# EasyEDA schematic SCH_PCEngineExpansionConnector_2024-10-27.json
TITLE: MegaExpress PC-Engine Expansion Slot Breakout; REV: 1.0; Date: 2024-10-03; Sheet: 1/1; Drawn By: jonn.blanchard; Company: RE:Enthused
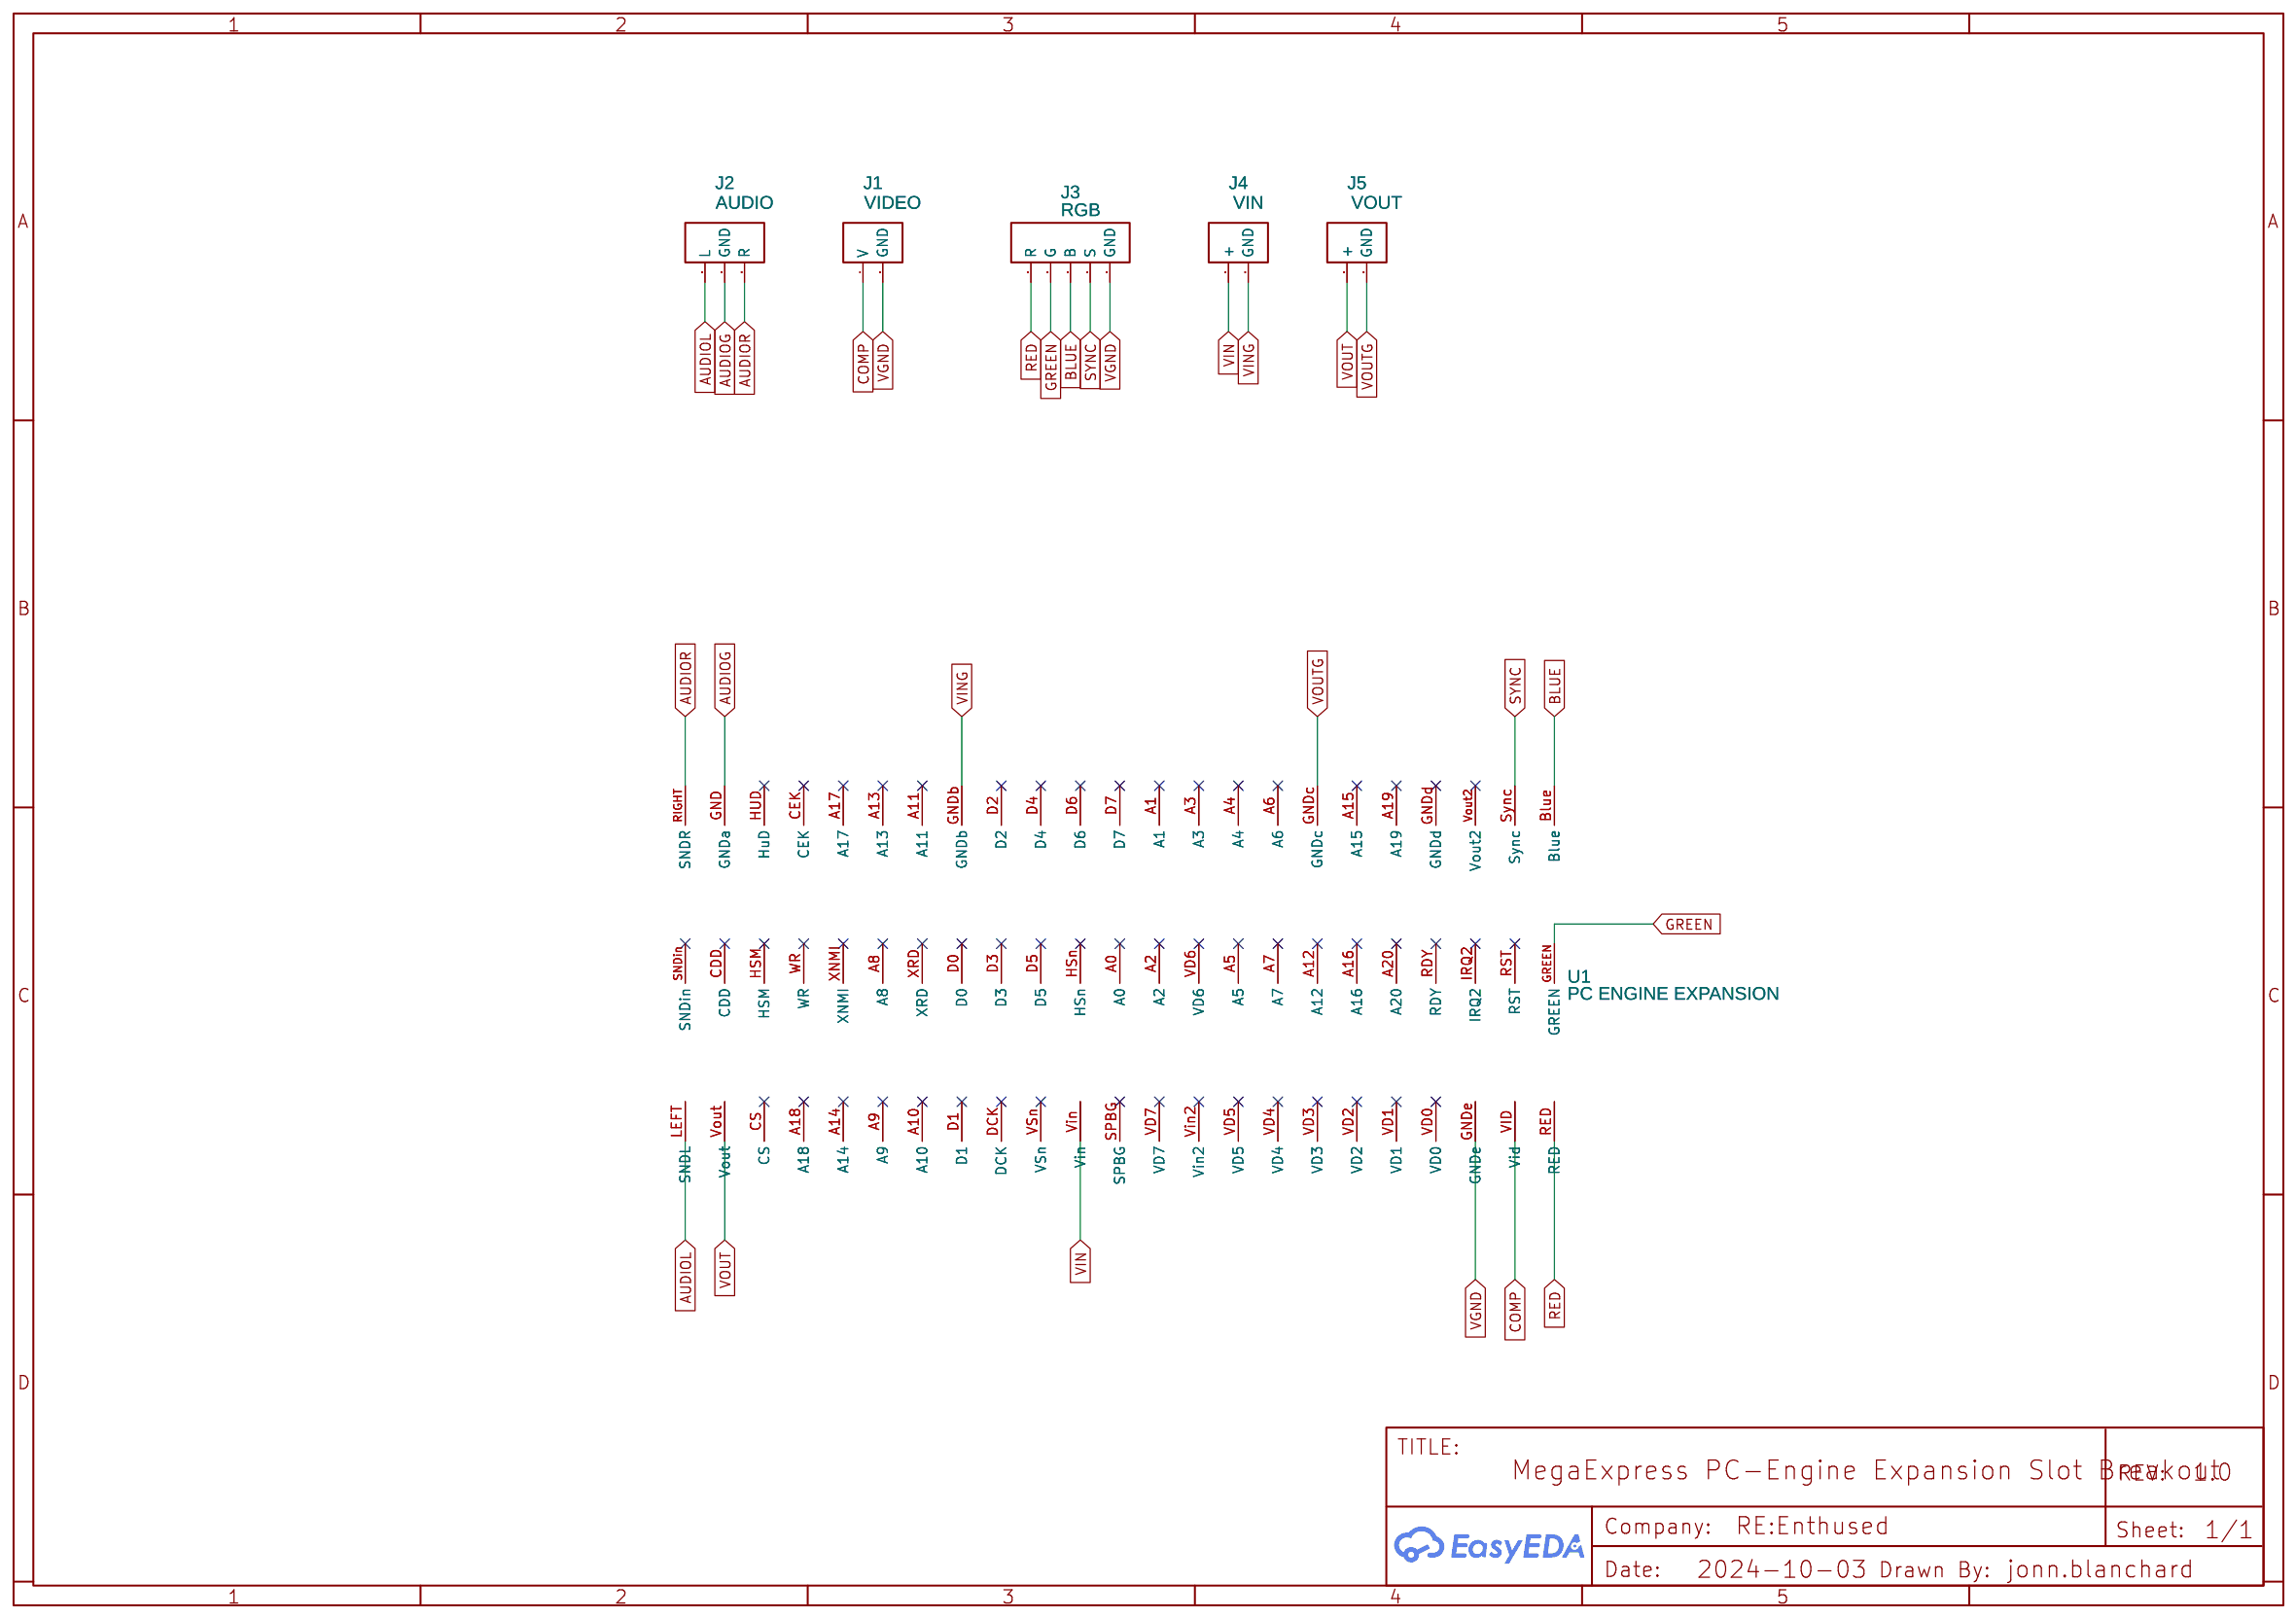
[diagram p0: schematic sheet]

## Parts
J1  VIDEO  [HDR-M-2.54_1X2]
J2  AUDIO  [HDR-M-2.54_1X3]
J3  RGB  [HDR-M-2.54_1X5]
J4  VIN  [HDR-M-2.54_1X2]
J5  VOUT  [HDR-M-2.54_1X2]
U1  PC ENGINE EXPANSION  [PC ENGINE EXPANSION]

## Library data of the parts
J1 J4 J5 = HDR-M-2.54_1x2: Supplier Part: C124375; Supplier: LCSC; Contributor: LCEDA_Lib
J2 = HDR-M-2.54_1x3: Supplier Part: C180248; Supplier: LCSC; Contributor: LCEDA_Lib
J3 = HDR-M-2.54_1x5: Supplier Part: C358687; Supplier: LCSC; Contributor: LCEDA_Lib
U1 = PC ENGINE EXPANSION: Contributor: jonn.blanchard

## Nets
VIN: J4.1(+) U1.Vin
VING: J4.2(GND) U1.GNDb
AUDIOG: J2.2(GND) U1.GND(GNDa)
AUDIOL: J2.1(L) U1.LEFT(SNDL)
AUDIOR: J2.3(R) U1.RIGHT(SNDR)
BLUE: J3.3(B) U1.Blue
COMP: J1.1(V) U1.VID(Vid)
GREEN: J3.2(G) U1.GREEN
RED: J3.1(R) U1.RED
SYNC: J3.4(S) U1.Sync
VGND: J1.2(GND) J3.5(GND) U1.GNDe
VOUT: J5.1(+) U1.Vout
VOUTG: J5.2(GND) U1.GNDc

Not connected (* = marked no-connect by the designer): U1 A0* A1* A2* A3* A4* A5* A6* A7* A8* A9* A10* A11* A12* A13* A14* A15* A16* A17* A18* A19* A20* CDD* CEK* CS* D0* D1* D2* D3* D4* D5* D6* D7* DCK* GNDd* HSM* HSn* HUD(HuD)* IRQ2* RDY* RST* SNDin* SPBG* VD0* VD1* VD2* VD3* VD4* VD5* VD6* VD7* Vin2* Vout2* VSn* WR* XNMI* XRD*
